# Altium schematic sheet MATRIX-x1.SchDoc
size A4; SheetNumber: 1; SheetTotal: 1
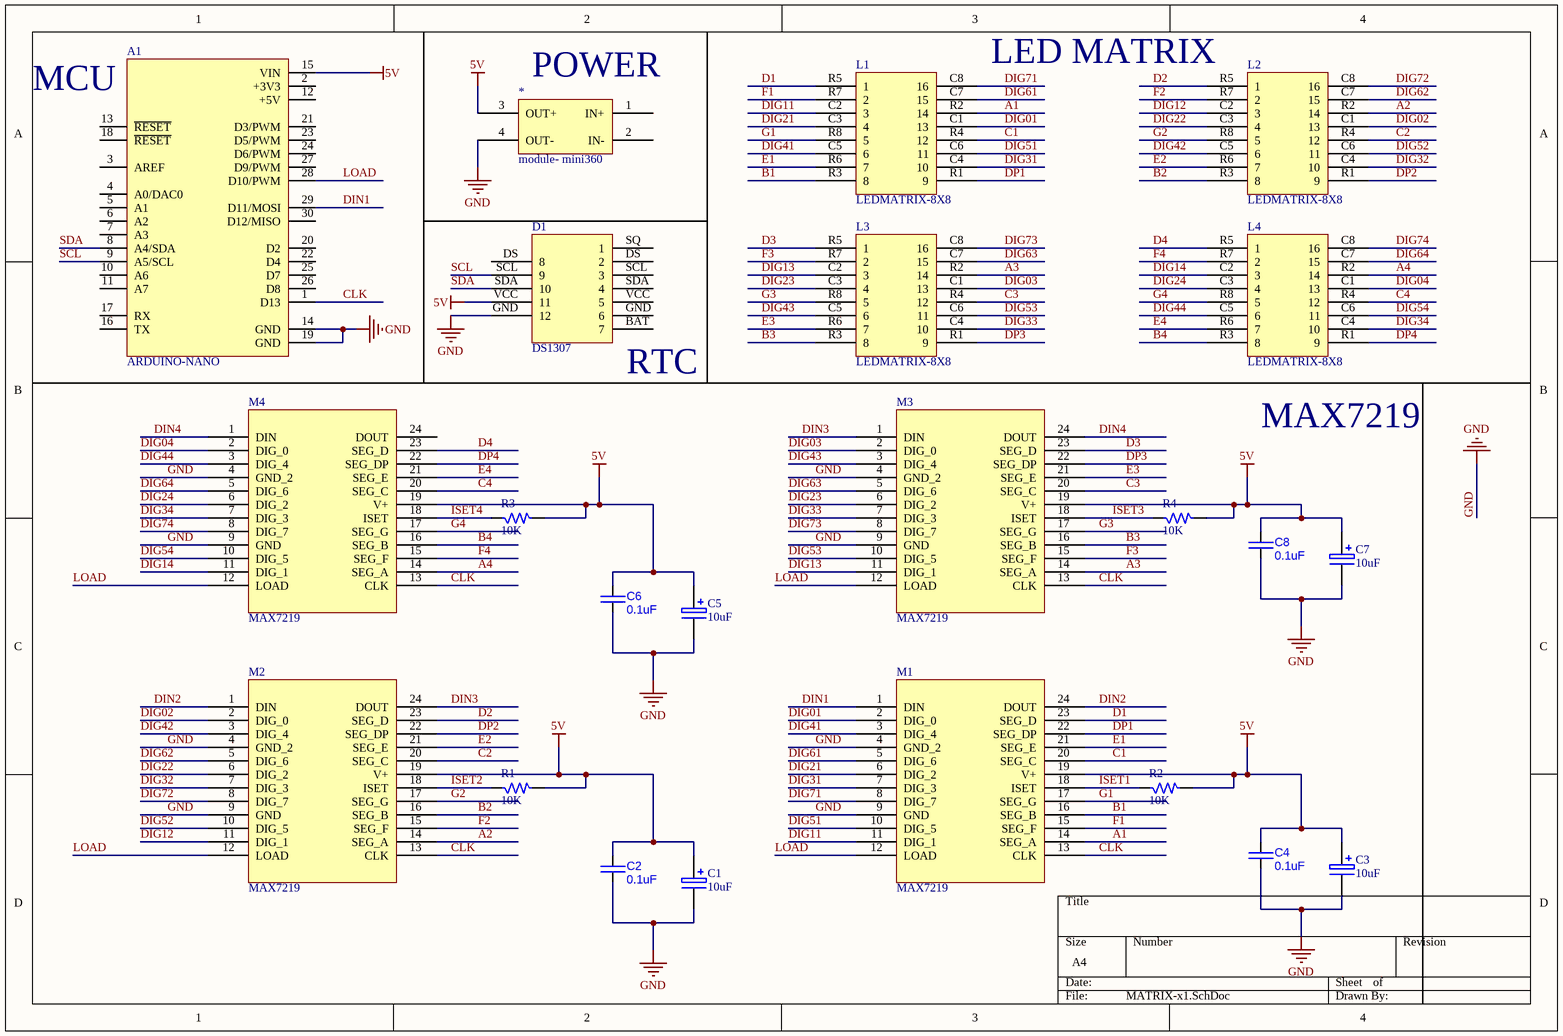
[diagram p0: MATRIX-x1.SchDoc]

## Parts
*  module- mini360  [MODULE-MINI360]
A1  ARDUINO-NANO  [ARDUINO-NANO]
C1  10uF  [CP1/2]
C2  value 0.1uF  [CAPC2012X135N]  (hidden comment: approved sub OK)
C3  10uF  [CP1/2]
C4  value 0.1uF  [CAPC2012X135N]  (hidden comment: approved sub OK)
C5  10uF  [CP1/2]
C6  value 0.1uF  [CAPC2012X135N]  (hidden comment: approved sub OK)
C7  10uF  [CP1/2]
C8  value 0.1uF  [CAPC2012X135N]  (hidden comment: approved sub OK)
D1  DS1307  [DS1307-MODULE]
L1  LEDMATRIX-8X8  [LEDMATRIX_8X8]
L2  LEDMATRIX-8X8  [LEDMATRIX_8X8]
L3  LEDMATRIX-8X8  [LEDMATRIX_8X8]
L4  LEDMATRIX-8X8  [LEDMATRIX_8X8]
M1  MAX7219  [MAX7219]
M2  MAX7219  [MAX7219]
M3  MAX7219  [MAX7219]
M4  MAX7219  [MAX7219]
R1  10K  [SM-RES-1206]
R2  10K  [SM-RES-1206]
R3  10K  [SM-RES-1206]
R4  10K  [SM-RES-1206]

## Nets
5V: *.3(OUT+) A1.15(VIN) C1.1 C2.1 C3.1 C4.1 C5.1 C6.1 C7.1 C8.1 D1.VCC(11) M1.19(V+) M2.19(V+) M3.19(V+) M4.19(V+) R1.2 R2.2 R3.2 R4.2
GND: *.4(OUT-) A1.14(GND) A1.19(GND) C1.2 C2.2 C3.2 C4.2 C5.2 C6.2 C7.2 C8.2 D1.GND(12) M1.4(GND_2) M1.9(GND) M2.4(GND_2) M2.9(GND) M3.4(GND_2) M3.9(GND) M4.4(GND_2) M4.9(GND)
A1: L1.R2(14) M1.14(SEG_A)
A2: L2.R2(14) M2.14(SEG_A)
A3: L3.R2(14) M3.14(SEG_A)
A4: L4.R2(14) M4.14(SEG_A)
B1: L1.R3(8) M1.16(SEG_B)
B2: L2.R3(8) M2.16(SEG_B)
B3: L3.R3(8) M3.16(SEG_B)
B4: L4.R3(8) M4.16(SEG_B)
C1: L1.R4(12) M1.20(SEG_C)
C2: L2.R4(12) M2.20(SEG_C)
C3: L3.R4(12) M3.20(SEG_C)
C4: L4.R4(12) M4.20(SEG_C)
CLK: A1.1(D13) M1.13(CLK) M2.13(CLK) M3.13(CLK) M4.13(CLK)
D1: L1.R5(1) M1.23(SEG_D)
D2: L2.R5(1) M2.23(SEG_D)
D3: L3.R5(1) M3.23(SEG_D)
D4: L4.R5(1) M4.23(SEG_D)
DIG01: L1.C1(13) M1.2(DIG_0)
DIG02: L2.C1(13) M2.2(DIG_0)
DIG03: L3.C1(13) M3.2(DIG_0)
DIG04: L4.C1(13) M4.2(DIG_0)
DIG11: L1.C2(3) M1.11(DIG_1)
DIG12: L2.C2(3) M2.11(DIG_1)
DIG13: L3.C2(3) M3.11(DIG_1)
DIG14: L4.C2(3) M4.11(DIG_1)
DIG21: L1.C3(4) M1.6(DIG_2)
DIG22: L2.C3(4) M2.6(DIG_2)
DIG23: L3.C3(4) M3.6(DIG_2)
DIG24: L4.C3(4) M4.6(DIG_2)
DIG31: L1.C4(10) M1.7(DIG_3)
DIG32: L2.C4(10) M2.7(DIG_3)
DIG33: L3.C4(10) M3.7(DIG_3)
DIG34: L4.C4(10) M4.7(DIG_3)
DIG41: L1.C5(6) M1.3(DIG_4)
DIG42: L2.C5(6) M2.3(DIG_4)
DIG43: L3.C5(6) M3.3(DIG_4)
DIG44: L4.C5(6) M4.3(DIG_4)
DIG51: L1.C6(11) M1.10(DIG_5)
DIG52: L2.C6(11) M2.10(DIG_5)
DIG53: L3.C6(11) M3.10(DIG_5)
DIG54: L4.C6(11) M4.10(DIG_5)
DIG61: L1.C7(15) M1.5(DIG_6)
DIG62: L2.C7(15) M2.5(DIG_6)
DIG63: L3.C7(15) M3.5(DIG_6)
DIG64: L4.C7(15) M4.5(DIG_6)
DIG71: L1.C8(16) M1.8(DIG_7)
DIG72: L2.C8(16) M2.8(DIG_7)
DIG73: L3.C8(16) M3.8(DIG_7)
DIG74: L4.C8(16) M4.8(DIG_7)
DIN1: A1.29(D11/MOSI) M1.1(DIN)
DIN2: M1.24(DOUT) M2.1(DIN)
DIN3: M2.24(DOUT) M3.1(DIN)
DIN4: M3.24(DOUT) M4.1(DIN)
DP1: L1.R1(9) M1.22(SEG_DP)
DP2: L2.R1(9) M2.22(SEG_DP)
DP3: L3.R1(9) M3.22(SEG_DP)
DP4: L4.R1(9) M4.22(SEG_DP)
E1: L1.R6(7) M1.21(SEG_E)
E2: L2.R6(7) M2.21(SEG_E)
E3: L3.R6(7) M3.21(SEG_E)
E4: L4.R6(7) M4.21(SEG_E)
F1: L1.R7(2) M1.15(SEG_F)
F2: L2.R7(2) M2.15(SEG_F)
F3: L3.R7(2) M3.15(SEG_F)
F4: L4.R7(2) M4.15(SEG_F)
G1: L1.R8(5) M1.17(SEG_G)
G2: L2.R8(5) M2.17(SEG_G)
G3: L3.R8(5) M3.17(SEG_G)
G4: L4.R8(5) M4.17(SEG_G)
ISET1: M1.18(ISET) R2.1
ISET2: M2.18(ISET) R1.1
ISET3: M3.18(ISET) R4.1
ISET4: M4.18(ISET) R3.1
LOAD: A1.28(D10/PWM) M1.12(LOAD) M2.12(LOAD) M3.12(LOAD) M4.12(LOAD)
SCL: A1.9(A5/SCL) D1.SCL(9)
SDA: A1.8(A4/SDA) D1.SDA(10)

Not connected (* = marked no-connect by the designer): * 1(IN+) 2(IN-); A1 2(+3V3) 3(AREF) 4(A0/DAC0) 5(A1) 6(A2) 7(A3) 10(A6) 11(A7) 12(+5V) 13(~{RESET}) 16(TX) 17(RX) 18(~{RESET}) 20(D2) 21(D3/PWM) 22(D4) 23(D5/PWM) 24(D6/PWM) 25(D7) 26(D8) 27(D9/PWM) 30(D12/MISO); D1 BAT(7) DS(8) SQ(1); M4 24(DOUT)

## Notes on the sheet
- (near A1) MCU
- (near *) POWER
- LED MATRIX
- (near D1) RTC
- MAX7219

## Library data of the parts
C1 C3 C5 C7 = CAP hoa: Cap
C2 C4 C6 C8 = CAP C_0805: Capacitor SMD Cer 1.8nF 10% 50V X7R 0805; Manufacturer 1: AVX Corporation; Manufacturer Part Number 1: 08055C182KAT2A; Ratings: 50V; X7R; SCDType: source*; Tolerance: ±10%; Operating Temperature: -55°C ~ 125°C; Package / Case: 0805 (2012 metric); Supplier 1: Digi-Key; Supplier Part Number 1: 478-1374-1-ND
D1 = DS1307_MODULE
R1-R4 = R: Resistor 1/4W; Value: R1/4W - 1K